# Altium schematic sheet GP_LDO_Circuit_Sheet.SchDoc
size A; SheetNumber: 2; SheetTotal: 3
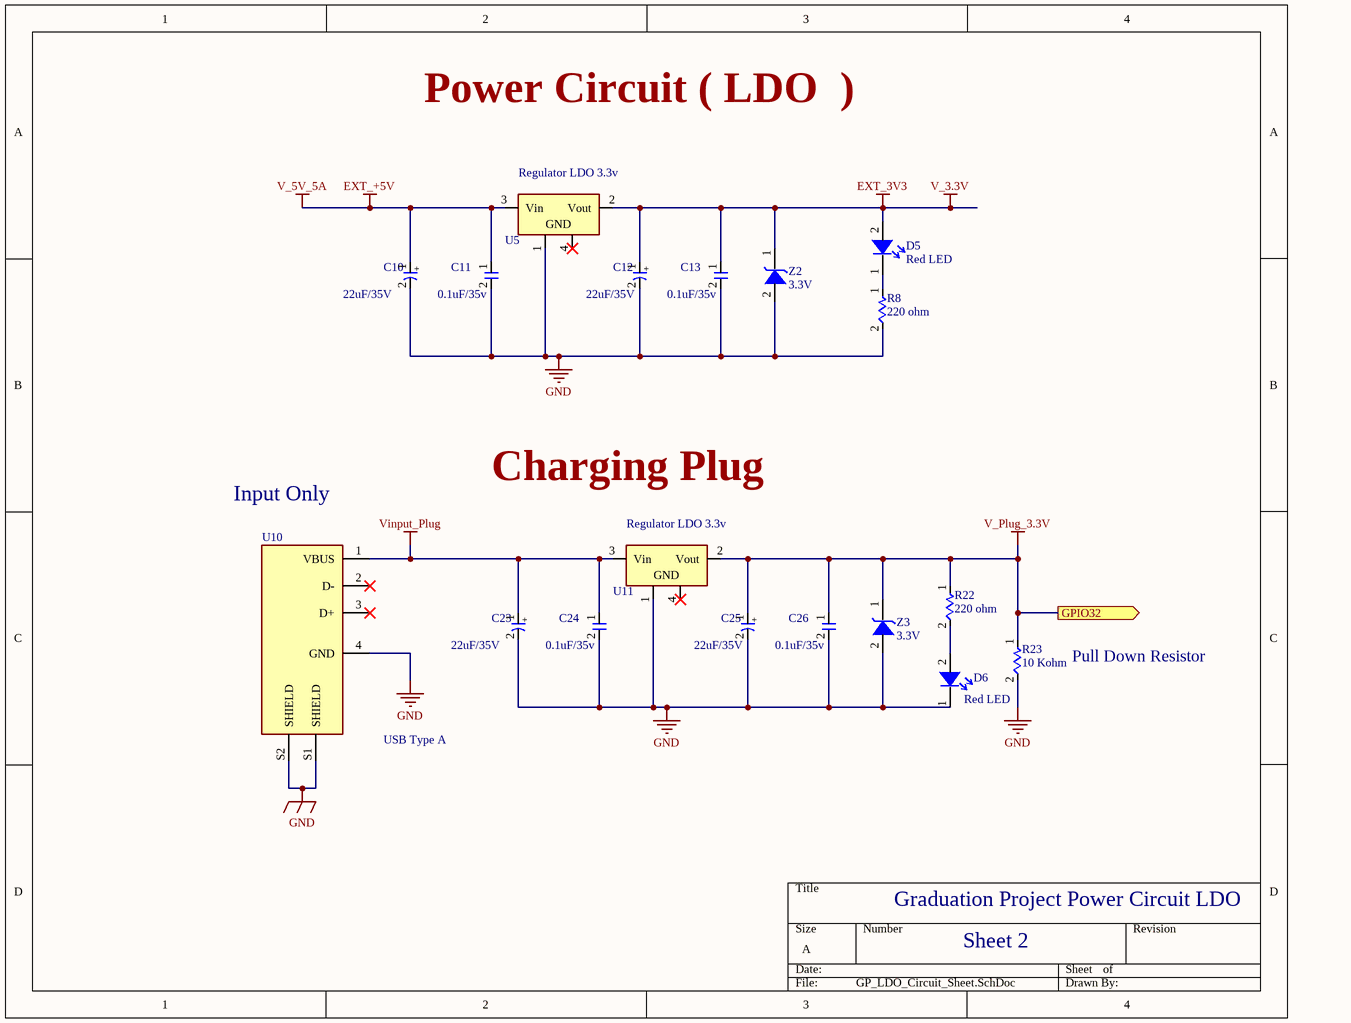
[diagram p0: GP_LDO_Circuit_Sheet.SchDoc]

## Parts
C10  22uF/35V  [Electrolytic Capacitor 22UF]
C11  0.1uF/35v  [Capacitor 100nF]
C12  22uF/35V  [Electrolytic Capacitor 22UF]
C13  0.1uF/35v  [Capacitor 100nF]
C23  22uF/35V  [Electrolytic Capacitor 22UF]
C24  0.1uF/35v  [Capacitor 100nF]
C25  22uF/35V  [Electrolytic Capacitor 22UF]
C26  0.1uF/35v  [Capacitor 100nF]
D5  Red LED  [Red Led]
D6  Red LED  [Red Led]
R8  220 ohm  [Resistor 1Kohm]
R22  220 ohm  [Resistor 1Kohm]
R23  10 Kohm  [Resistor 1Kohm]
U5  Regulator LDO 3.3v  [LDO 3.3V]
U10  USB Type A  [USB Type A]
U11  Regulator LDO 3.3v  [LDO 3.3V]
Z2  3.3V  [Zener 3.3V Diode]
Z3  3.3V  [Zener 3.3V Diode]

## Ports
GPIO32 (out, see GP_ESP32_Circuit_Sheet[5C])

## Nets
EXT_3V3: C12.1(Pin_1) C13.1(Pin_1) D5.2 U5.2(Vout) Z2.1  [also labelled V_3.3V]
EXT_+5V: C10.1(Pin_1) C11.1(Pin_1) U5.3(Vin)  [also labelled V_5V_5A]
GND: C10.2(Pin_2) C11.2(Pin_2) C12.2(Pin_2) C13.2(Pin_2) C23.2(Pin_2) C24.2(Pin_2) C25.2(Pin_2) C26.2(Pin_2) D6.1 R8.2(pin_2) R23.2(pin_2) U5.1(GND) U10.4(GND) U10.S1(SHIELD) U10.S2(SHIELD) U11.1(GND) Z2.2 Z3.2
V_Plug_3.3V: C25.1(Pin_1) C26.1(Pin_1) R22.1(Pin_1) R23.1(Pin_1) U11.2(Vout) Z3.1 ; port GPIO32
Vinput_Plug: C23.1(Pin_1) C24.1(Pin_1) U10.1(VBUS) U11.3(Vin)
NetD5_1: D5.1 R8.1(Pin_1)
NetD6_2: D6.2 R22.2(pin_2)

Not connected (* = marked no-connect by the designer): U5 4(GND)*; U10 2(D-)* 3(D+)*; U11 4(GND)*

## Notes on the sheet
- Power Circuit ( LDO  )
- (near U10) Input Only
- Charging Plug
- Pull Down Resistor
- Graduation Project Power Circuit LDO
- Sheet 2
- (in symbol Electrolytic Capacitor 22UF) +

## Library data of the parts
C10 C12 C23 C25 = Electrolytic Capacitor 22UF: Electrolytic Capacitor (22UF , 35V)SMD Radial Electrolytic Capacitor; ComponentLink1Description: Market Link; ComponentLink1URL: https://free-electronic.com/product/smd-electrolytic-capacitor-22uf-35v/
C11 C13 C24 C26 = Capacitor 100nF: Ceramic Capacitor (100nF , 50V) SMD (1206); Parameter 1: *; ComponentLink1Description: Link; ComponentLink1URL: https://free-electronic.com/product/ceramic-capacitor-100nf-50v-smd-1206/
D5 D6 = Red LED: 2012 Smd Led Red; ComponentLink1Description: Part Number; ComponentLink1URL: SM0603UYC; ComponentLink2Description: Market Link; ComponentLink2URL: https://free-electronic.com/product/2012-smd-led-red/
R8 R22 R23 = Resistor 1 Kohm: SMD RESISTORS 200V-500V 1206; ComponentLink1Description: Part Number; ComponentLink1URL: A1-20-1206-4.7K; ComponentLink2Description: Market Link; ComponentLink2URL: https://free-electronic.com/product/smd-resistor-1-kohm-1-4w/
U5 U11 = Regulator LDO 3.3v: (+3.3V , 800mA ) Low-Dropout Voltage Regulator.(TO-220); ComponentLink1Description: Part Number; ComponentLink1URL: LM1117T-3.3; ComponentLink2Description: Market Link; ComponentLink2URL: https://free-electronic.com/product/ams1117-3-3-smd/; ComponentLink3Description: New link; ComponentLink3URL: *
Z2 Z3 = Zener 3.3V: Zener Diodes ( 3.3V ) SMD SOD-123; ComponentLink1Description: Market Link; ComponentLink1URL: https://free-electronic.com/product/mm1z3v3-w3-smd/